# EAGLE schematic Board (EAGLE 9.6.1)
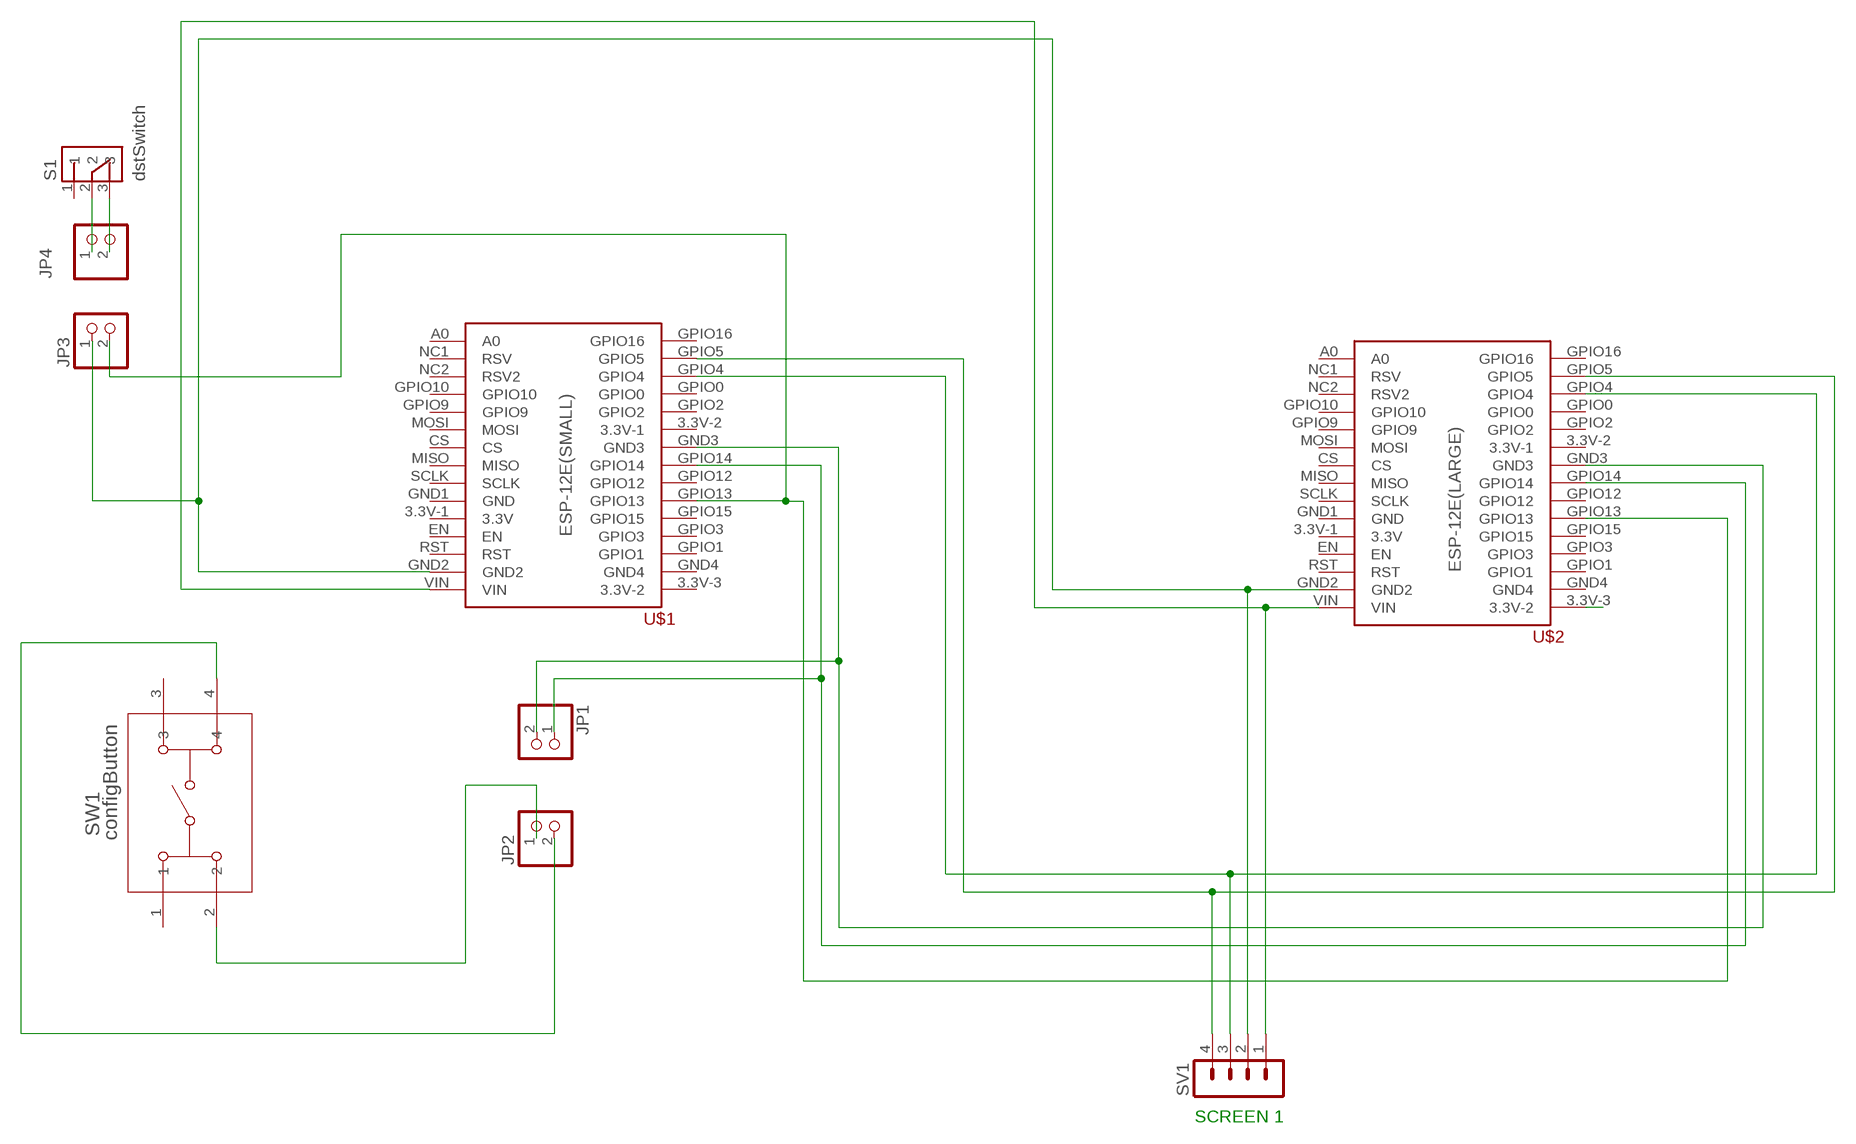
[diagram p0: schematic, sheet 1]

## Parts
JP1  PINHD-1X2/90  [1X02/90]
JP2  PINHD-1X2/90  [1X02/90]
JP3  PINHD-1X2/90  [1X02/90]
JP4  PINHD-1X2/90  [1X02/90]
S1  dstSwitch  OS102011MS2QN1  [SW_OS102011MS2QN1]
SV1  MA04-1  [MA04-1]
SW1  configButton  1825910-6  [SW4_1825910-B_TEC]
U$1  ESP-12F(SMALL)  [ESP-12E(SMALL)]
U$2  ESP-12F(LARGE)  [ESP-12E(LARGE)]

## Nets
N$1: JP1.1 U$1.GPIO14 U$2.GPIO14
N$2: JP1.2 U$1.GND3 U$2.GND3
N$5: JP3.2 U$1.GPIO13 U$2.GPIO13
N$14: JP3.1 SV1.2 U$1.GND2 U$2.GND2
N$15: SV1.1 U$1.VIN U$2.VIN
N$28: SV1.3 U$1.GPIO4 U$2.GPIO4
N$29: SV1.4 U$1.GPIO5 U$2.GPIO5
N$31: JP4.1 S1.2
N$32: JP4.2 S1.3
N$33: JP2.1 SW1.2
N$34: JP2.2 SW1.4
N$47: U$2.3.3V-3(3.3V-2)
Unconnected: S1.1 SW1.1 SW1.3 U$1.3.3V-1(3.3V) U$1.3.3V-2(3.3V-1) U$1.3.3V-3(3.3V-2) U$1.A0 U$1.CS U$1.EN U$1.GND1(GND) U$1.GND4 U$1.GPIO0 U$1.GPIO1 U$1.GPIO2 U$1.GPIO3 U$1.GPIO9 U$1.GPIO10 U$1.GPIO12 U$1.GPIO15 U$1.GPIO16 U$1.MISO U$1.MOSI U$1.NC1(RSV) U$1.NC2(RSV2) U$1.RST U$1.SCLK U$2.3.3V-1(3.3V) U$2.3.3V-2(3.3V-1) U$2.A0 U$2.CS U$2.EN U$2.GND1(GND) U$2.GND4 U$2.GPIO0 U$2.GPIO1 U$2.GPIO2 U$2.GPIO3 U$2.GPIO9 U$2.GPIO10 U$2.GPIO12 U$2.GPIO15 U$2.GPIO16 U$2.MISO U$2.MOSI U$2.NC1(RSV) U$2.NC2(RSV2) U$2.RST U$2.SCLK

## Notes on the sheet
- SCREEN 1

## Library data of the parts
JP1-JP4 = pinhead:PINHD-1X2: PIN HEADER
S1 = MonroeKyle:OS102011MS2QN1: Switch Slide ON ON SPDT Top Slide 0.1A 12VDC 10000Cycles PC Pins Thru-Hole Bulk; DESCRIPTION: SLIDE SWITCH SPDT T/H ON-ON BBM; DIGI-KEY_PART_NUMBER: CKN12284-ND; MF: C&K; MP: OS102011MS2QN1; PACKAGE: None; PURCHASE-URL: https://pricing.snapeda.com/search/part/OS102011MS2QN1/?ref=eda
SV1 = con-lstb:MA04-1: PIN HEADER; OC_FARNELL: unknown; OC_NEWARK: unknown
SW1 = MonroeKyle:1825910-6; BUILT_BY: EMA_UL_Team; CONFIGURATION__POLE-THROW_: Single Pole - Single Throw; COPYRIGHT: Copyright (C) 2016 Accelerated Designs. All rights reserved; DESCRIPTION: FSM4JH=6MM TACT SWITCH, HIGH TEMP; MANUFACTURER_PART_NUMBER: 1825910-6; MAX_SWITCHING_CURRENT: -; MAX_SWITCHING_VOLTAGE_AC_: -; PRODUCT_TYPE: Switch; SOURCELIBRARY: TE_Connectivity-2018-03-16; SWITCH_TYPE: Tactile Switches; TE_PART_NUMBER: 1825910-6; VENDOR: TE Connectivity
U$1 = MonroeKyle:ESP-12F(SMALL): ESP-12E (smaller variant)
U$2 = MonroeKyle:ESP-12F(LARGE): ESP-12E (larger variant)